# EAGLE design untitled (EAGLE 6.1)
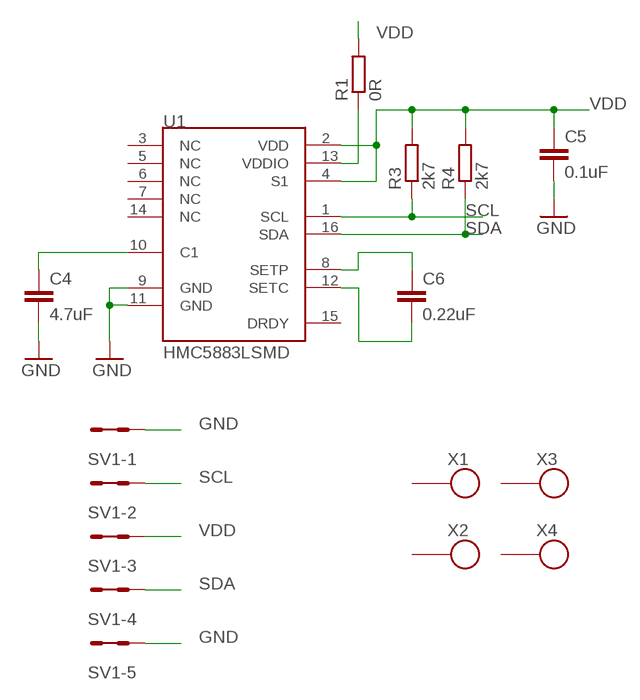
[diagram p0: schematic, sheet 1]

## Parts
C4  4.7uF  C0805  [C0805]
C5  0.1uF  C0805  [C0805]
C6  0.22uF  C0805  [C0805]
R1  0R  R1206  [1206]
R3  2k7  R0805  [0805]
R4  2k7  R0805  [0805]
SV1  MA05-2  [MA05-2]
U1  HMC5883LSMD  [16LPCC]
X1  SROUB3M  [SROUB3M]
X2  SROUB3M  [SROUB3M]
X3  SROUB3M  [SROUB3M]
X4  SROUB3M  [SROUB3M]

## Nets
GND: C4.2 C5.2 SV1.1 SV1.2 SV1.9 SV1.10 U1.9(GND) U1.11(GND)
N$1: C4.1 U1.10(C1)
N$2: R1.1 U1.13(VDDIO)
N$4: C6.1 U1.8(SETP)
N$5: C6.2 U1.12(SETC)
SCL: R3.1 SV1.3 SV1.4 U1.1(SCL)
SDA: R4.1 SV1.7 SV1.8 U1.16(SDA)
VDD: C5.1 R1.2 R3.2 R4.2 SV1.5 SV1.6 U1.2(VDD) U1.4(S1)
Unconnected: U1.3(NC) U1.5(NC) U1.6(NC) U1.7(NC) U1.14(NC) U1.15(DRDY) X1.P$1 X2.P$1 X3.P$1 X4.P$1

## Notes on the sheet
- VDD
- VDD
- GND
- SCL
- VDD
- SDA
- GND

## Library data of the parts
C4-C6 = moje_C:C0805
R1 = moje_R:R1206
R3 R4 = moje_R:R0805
SV1 = moje_hrebinky:MA05-2: PIN HEADER; OC_FARNELL: unknown; OC_NEWARK: unknown
U1 = SparkFun:HMC5883L: 3 Axis Digital Compass IC
X1-X4 = moje:SROUB3M

## Board
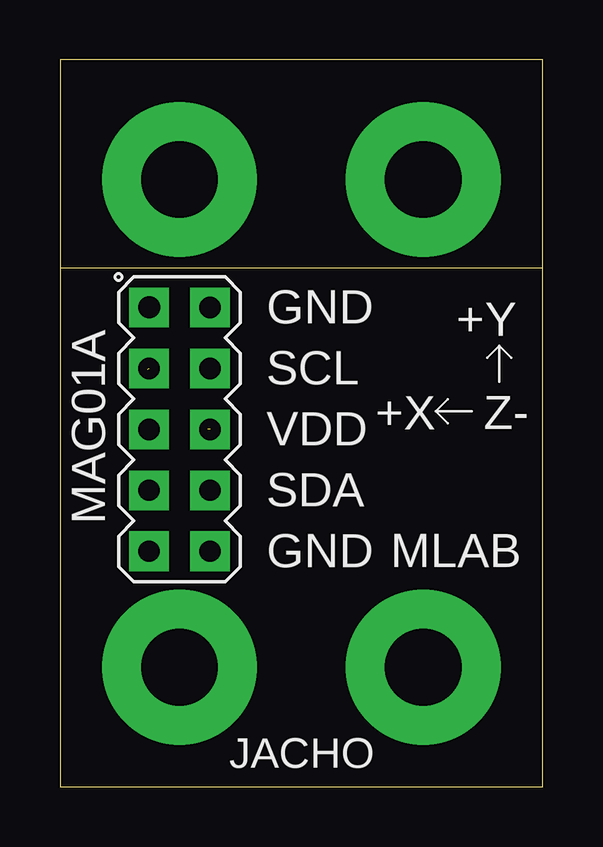
[diagram p1: board, top side]
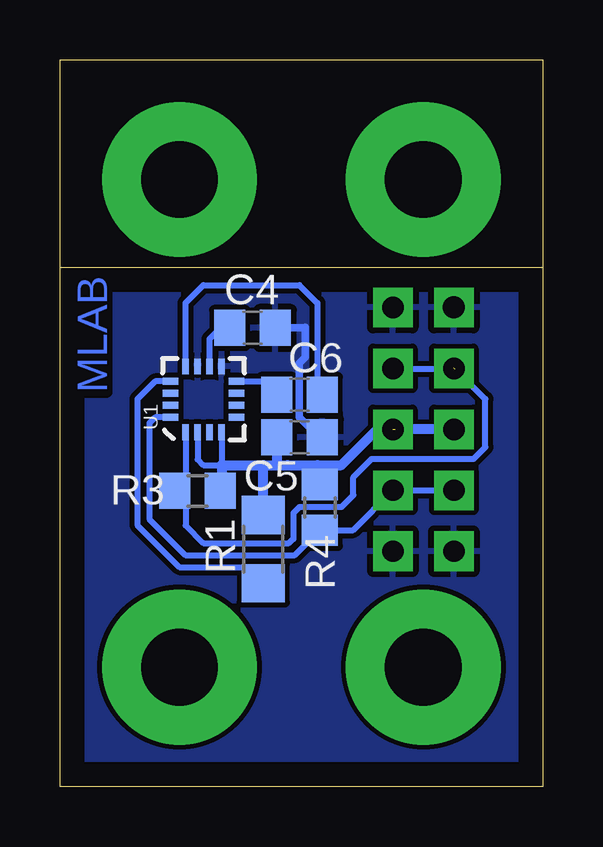
[diagram p2: board, bottom side, seen from below]

Size 20.12 x 30.28 mm. Coordinates in mm from the lower left corner, seen from the top.
Outline: 20.12,21.62 20.12,0 0,0 0,21.62
Outline: 20.12,21.62 20.12,30.28 0,30.28 0,21.62
Outline: 0,21.62 20.12,21.62
Copper layers (1*16): Top 0.035mm / dielectric 1.5mm / Bottom 0.035mm
Design rules: minimum track width 10mil, minimum drill 24mil, track to track 8mil, track to pad 8mil, pad to pad 8mil, via to via 8mil, smd to smd 8mil, copper to edge 40mil, drill to drill 8mil, minimum pad ring 10mil, minimum via ring 8mil, stop-mask expansion 4mil, vias tented up to drill 0mil, thermal gap 10mil

### Footprints (pad centres in the part's own frame; a part is rotated, then mirrored left to right if it is on the bottom)
C0805 = smd 1.3 x 1.5: 1 -0.95,0; 2 0.95,0
1206 = smd 1.6 x 1.803: 1 -1.422,0; 2 1.422,0
0805 = smd 1.3 x 1.5: 1 -0.95,0; 2 0.95,0
MA05-2 = drill 0.914 pad 1.651 square: 1 -5.08,-1.27 | drill 0.889 pad 1.651 square: 2 -5.08,1.27; 3 -2.54,-1.27; 4 -2.54,1.27; 5 0,-1.27; 6 0,1.27; 7 2.54,-1.27; 8 2.54,1.27; 9 5.08,-1.27; 10 5.08,1.27
16LPCC = smd 0.65 x 0.28: 1 -1.37,0.75; 2 -1.37,0.25; 3 -1.37,-0.25; 4 -1.37,-0.75; 9 1.37,-0.75; 10 1.37,-0.25; 11 1.37,0.25; 12 1.37,0.75 | smd 0.28 x 0.65: 5 -0.75,-1.37; 6 -0.25,-1.37; 7 0.25,-1.37; 8 0.75,-1.37; 13 0.75,1.37; 14 0.25,1.37; 15 -0.25,1.37; 16 -0.75,1.37
SROUB3M = drill 3.2 pad 6.452: P$1 0,0

### Placement (x,y rotation side)
C4  12.1,19.12 0 bottom
C5  10.14,14.56 0 bottom
C6  10.14,16.33 0 bottom
R1  11.65,9.9 90 bottom
R3  14.39,12.33 0 bottom
R4  9.29,11.64 90 bottom
SV1  4.98,14.89 270 top
U1  14.14,16.14 90 bottom
X1  4.98,4.98 0 top
X2  4.98,25.3 0 top
X3  15.14,4.98 0 top
X4  15.14,25.3 0 top

### Tracks (layer width: path | path; a pad name or v marks a point on that pad's centre or on a via)
GND
  Bottom 0.305: C4.2 9.93,19.12 9.9,19.15 9.9,17.9 10.15,17.65 10.15,15.4 9.15,14.4 9.15,14.65
  pour Bottom: -0.1,-0.1 -0.1,21.9 20.15,21.9 20.15,-0.1
N$1
  Bottom 0.254: U1.10 13.89,18.66 12.9,19.65 13.02,19.65 C4.1
N$2
  Bottom 0.254: U1.13 16.16,16.89 16.9,16.15 16.9,10.9 15.15,9.15 12.4,9.15 12.15,8.9 12.07,8.9 R1.1
N$4
  Bottom 0.254: U1.8 11.4,16.89 11.4,15.89 C6.1
N$5
  Bottom 0.254: U1.12 14.89,20.16 14.15,20.9 10.15,20.9 9.4,20.15 9.4,15.79 C6.2
SCL  (1 unrouted)
  Bottom 0.254: U1.1 14.89,12.33 | 14.89,12.33 R3.1 | 14.89,12.33 14.89,10.89 14.15,10.15 10.58,10.15 10.4,10.33 10.4,11.4 10.15,11.65 8.4,11.65 7.9,12.15 7.9,12.9 7.15,13.65 2.9,13.65 2.4,14.15 2.4,16.15 3.65,17.4 6.22,17.4 SV1.4
SDA
  Bottom 0.254: SV1.7 SV1.8 7.91,10.69 R4.1 10.33,9.65 14.9,9.65 16.4,11.15 16.4,15.15 16.16,15.39 U1.16
VDD  (1 unrouted)
  Bottom 0.254: U1.2 14.39,13.64 14.15,13.4 13.4,13.4 13.39,13.41 U1.4 | 13.39,12.53 R3.2 | 11.09,13.46 11.15,13.4 | 10.59,13.34 10.65,13.4
  Bottom 0.406: SV1.5 SV1.6 | 13.4,13.4 11.65,13.4 | 11.65,13.4 11.15,13.4 10.65,13.4 9.4,13.4 | 13.39,13.41 13.39,12.53 | C5.1 11.09,13.46 | 9.4,13.4 8.4,13.4 6.9,14.9 6.15,14.9 | R4.2 9.4,12.59 9.4,13.4 | R1.2 11.65,13.4
(copper drawn outside any net)
  shapes: Bottom circle x2

### Text on the board
Bottom: MLAB
tPlace: GND | +Y | SCL | +X | Z- | VDD | SDA | MAG01A | MLAB | GND | JACHO